# EAGLE schematic Lipo_singlecell_charger_mcp73831 (EAGLE 6.4)
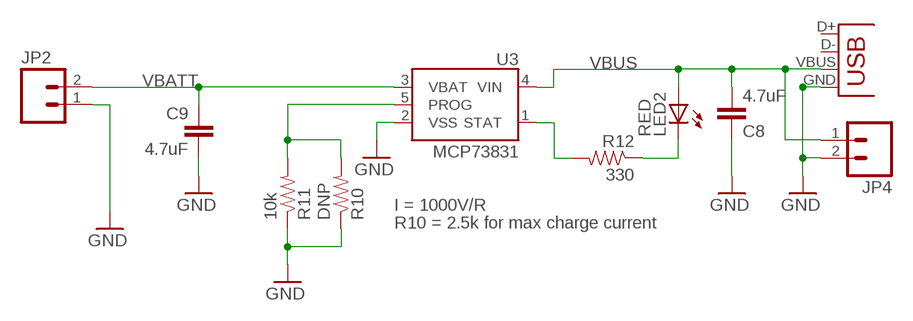
[diagram p0: schematic, sheet 1]

## Parts
C8  4.7uF  CAP0402-CAP  [0402-CAP]
C9  4.7uF  CAP0402-CAP  [0402-CAP]
JP2  M02-JST-2MM-SMT  [JST-2-SMD]
JP4  M021X02_NO_SILK  [1X02_NO_SILK]
LED2  RED  LED0603  [LED-0603]
R10  DNP  RESISTORPTH-1/6W  [1/6W-RES]
R11  10k  RESISTOR0402-RES  [0402-RES]
R12  330  RESISTOR0402-RES  [0402-RES]
U3  MCP73831  [SOT23-5]
X1  USBSMD  [USB-MINIB]

## Nets
GND: C8.1 C9.2 JP2.1 JP4.2 R10.1 R11.1 U3.2(VSS) X1.GND
N$5: LED2.C R12.1
PROG: R10.2 R11.2 U3.5(PROG)
STAT: R12.2 U3.1(STAT)
VBATT: C9.1 JP2.2 U3.3(VBAT)
VBUS: C8.2 JP4.1 LED2.A U3.4(VIN) X1.VBUS
Unconnected: X1.D+ X1.D-

## Notes on the sheet
- I = 1000V/R
- R10 = 2.5k for max charge current

## Library data of the parts
C8 C9 = SparkFun:CAP: Capacitor Standard 0603 ceramic capacitor, and 0.1" leaded capacitor.
JP2 JP4 = SparkFun:M02: Header 2 Standard 2-pin 0.1" header. Use with straight break away headers (SKU : PRT-00116), right angle break away headers (PRT-00553), swiss pins (PRT-00743), machine pins (PRT-00117), and female headers (PRT-00115). Molex polarized connector foot print use with SKU : PRT-08233 with associated crimp pins and housings.
LED2 = SparkFun:LED: LEDs Standard schematic elements and footprints for 5mm, 3mm, 1206, and 0603 sized LEDs. 5mm - Spark Fun Electronics SKU : COM-00529 (and others)
R10-R12 = SparkFun:RESISTOR: Resistor Basic schematic elements and footprints for 0603, 1206, and PTH resistors.
U3 = SparkFun:MCP73831: Microchip's MCP73831 Miniature single cell, fully integrated Li-Ion, Li-polymer charge management controller http://ww1.microchip.com/downloads/en/DeviceDoc/21984a.pdf
X1 = SparkFun:USB: USB Connectors USB-B-PTH is fully proven SKU : PRT-00139 USB-miniB is fully proven SKU : PRT-00587 USB-A-PCB is untested. USB-A-H is throughly reviewed, but untested. Spark Fun Electronics SKU : PRT-00437 USB-B-SMT is throughly reviewed, but untested. Needs silkscreen touching up. USB-A-S has not been used/tested USB-MB-H has not been used/tested